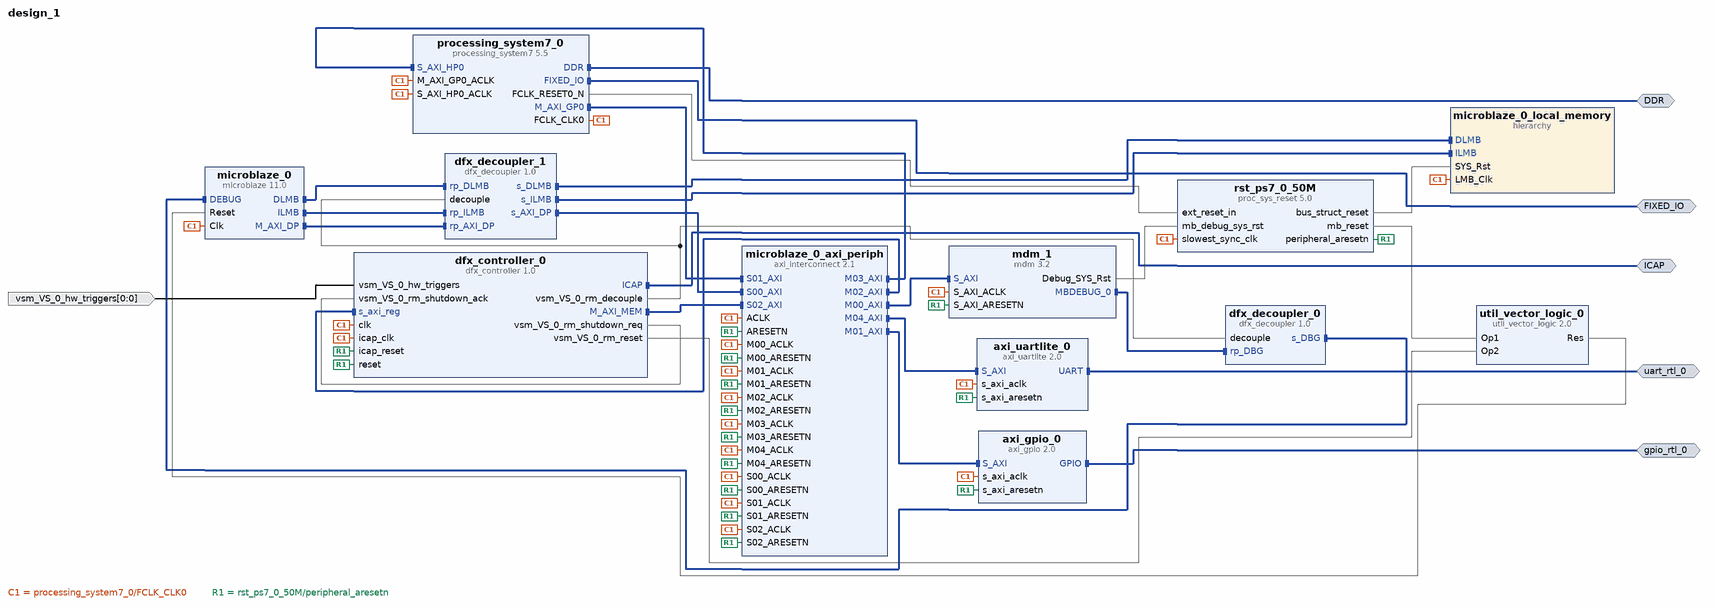
[diagram p0: block diagram of the top level]
# Vivado block design design_1, xc7z020clg400-1, Vivado 2021.1
create_bd_design design_1

create_bd_intf_port -mode Master -vlnv xilinx.com:display_processing_system7:fixedio_rtl:1.0 FIXED_IO
create_bd_intf_port -mode Master -vlnv xilinx.com:interface:gpio_rtl:1.0 gpio_rtl_0
create_bd_intf_port -mode Master -vlnv xilinx.com:interface:icap_rtl:1.0 ICAP
create_bd_intf_port -mode Master -vlnv xilinx.com:interface:ddrx_rtl:1.0 DDR
create_bd_intf_port -mode Master -vlnv xilinx.com:interface:uart_rtl:1.0 uart_rtl_0
create_bd_port -dir I -from 0 -to 0 vsm_VS_0_hw_triggers

create_bd_cell -type hier microblaze_0_local_memory
create_bd_cell -type ip -vlnv xilinx.com:ip:axi_interconnect:2.1 microblaze_0_axi_periph
set_property -dict {CONFIG.NUM_MI 5 CONFIG.NUM_SI 3} [get_bd_cells microblaze_0_axi_periph]
create_bd_cell -type ip -vlnv xilinx.com:ip:mdm:3.2 mdm_1
set_property -dict {CONFIG.C_ADDR_SIZE 32 CONFIG.C_M_AXI_ADDR_WIDTH 32 CONFIG.C_USE_UART 1} [get_bd_cells mdm_1]
create_bd_cell -type ip -vlnv xilinx.com:ip:proc_sys_reset:5.0 rst_ps7_0_50M
create_bd_cell -type ip -vlnv xilinx.com:ip:microblaze:11.0 microblaze_0
set_property -dict {CONFIG.C_D_AXI 1} [get_bd_cells microblaze_0]
create_bd_cell -type ip -vlnv xilinx.com:ip:axi_gpio:2.0 axi_gpio_0
set_property -dict {CONFIG.C_ALL_OUTPUTS 1 CONFIG.C_GPIO_WIDTH 1} [get_bd_cells axi_gpio_0]
create_bd_cell -type ip -vlnv xilinx.com:ip:dfx_controller:1.0 dfx_controller_0
set_property -dict [list \
  CONFIG.ALL_PARAMS {HAS_AXI_LITE_IF 1 RESET_ACTIVE_LEVEL 0 CP_FIFO_DEPTH 32 CP_FIFO_TYPE lutram CDC_STAGES 6 VS {VS_0 {ID 0 NAME VS_0 RM {UBLAZE {ID 0 NAME UBLAZE BS {0 {ID 0 ADDR 268435456 SIZE 389928 CLEAR 0}} RESET_REQUIRED high}} POR_RM UBLAZE HAS_POR_RM 1 NUM_HW_TRIGGERS 1}} CP_FAMILY 7series DIRTY 0} \
  CONFIG.GUI_BS_ADDRESS_0 0x10000000 \
  CONFIG.GUI_BS_SIZE_0 389928 \
  CONFIG.GUI_RM_NEW_NAME UBLAZE \
  CONFIG.GUI_RM_RESET_REQUIRED high \
  CONFIG.GUI_VS_HAS_POR_RM true \
  CONFIG.GUI_VS_NUM_HW_TRIGGERS 1 \
] [get_bd_cells dfx_controller_0]
create_bd_cell -type ip -vlnv xilinx.com:ip:util_vector_logic:2.0 util_vector_logic_0
set_property -dict {CONFIG.C_OPERATION or CONFIG.C_SIZE 1} [get_bd_cells util_vector_logic_0]
create_bd_cell -type ip -vlnv xilinx.com:ip:dfx_decoupler:1.0 dfx_decoupler_0
set_property -dict [list \
  CONFIG.ALL_PARAMS {INTF {DBG {ID 0 VLNV xilinx.com:interface:mbdebug_rtl:3.0 SIGNALS {CLK {PRESENT 1 WIDTH 1} TDI {PRESENT 1 WIDTH 1} TDO {PRESENT 1 WIDTH 1} REG_EN {PRESENT 1 WIDTH 8} SHIFT {PRESENT 1 WIDTH 1} CAPTURE {PRESENT 1 WIDTH 1} UPDATE {PRESENT 1 WIDTH 1} RST {PRESENT 1 WIDTH 1} TRIG_IN {PRESENT 1 WIDTH 1} TRIG_ACK_IN {PRESENT 1 WIDTH 1} TRIG_OUT {PRESENT 1 WIDTH 1} TRIG_ACK_OUT {PRESENT 1 WIDTH 1} TRCLK {PRESENT 1 WIDTH 1} TRDATA {PRESENT 1 WIDTH 1} TRREADY {PRESENT 1 WIDTH 1} TRVALID {PRESENT 1 WIDTH 1} AWADDR {PRESENT 1 WIDTH 1} AWVALID {PRESENT 1 WIDTH 1} AWREADY {PRESENT 1 WIDTH 1} WDATA {PRESENT 1 WIDTH 1} WVALID {PRESENT 1 WIDTH 1} WREADY {PRESENT 1 WIDTH 1} BRESP {PRESENT 1 WIDTH 1} BVALID {PRESENT 1 WIDTH 1} BREADY {PRESENT 1 WIDTH 1} ARADDR {PRESENT 1 WIDTH 1} ARVALID {PRESENT 1 WIDTH 1} ARREADY {PRESENT 1 WIDTH 1} RDATA {PRESENT 1 WIDTH 1} RRESP {PRESENT 1 WIDTH 1} RVALID {PRESENT 1 WIDTH 1} RREADY {PRESENT 1 WIDTH 1} DISABLE {PRESENT 1 WIDTH 1}}}} HAS_SIGNAL_STATUS 0 IPI_PROP_COUNT 0} \
  CONFIG.GUI_HAS_SIGNAL_STATUS false \
  CONFIG.GUI_INTERFACE_NAME DBG \
  CONFIG.GUI_SELECT_INTERFACE 0 \
  CONFIG.GUI_SELECT_VLNV xilinx.com:interface:mbdebug_rtl:3.0 \
  CONFIG.GUI_SIGNAL_DECOUPLED_0 true \
  CONFIG.GUI_SIGNAL_DECOUPLED_1 true \
  CONFIG.GUI_SIGNAL_DECOUPLED_2 true \
  CONFIG.GUI_SIGNAL_DECOUPLED_3 true \
  CONFIG.GUI_SIGNAL_DECOUPLED_4 true \
  CONFIG.GUI_SIGNAL_DECOUPLED_5 true \
  CONFIG.GUI_SIGNAL_DECOUPLED_6 true \
  CONFIG.GUI_SIGNAL_DECOUPLED_7 true \
  CONFIG.GUI_SIGNAL_DECOUPLED_8 true \
  CONFIG.GUI_SIGNAL_DECOUPLED_9 true \
  CONFIG.GUI_SIGNAL_SELECT_0 CLK \
  CONFIG.GUI_SIGNAL_SELECT_1 TDI \
  CONFIG.GUI_SIGNAL_SELECT_2 TDO \
  CONFIG.GUI_SIGNAL_SELECT_3 REG_EN \
  CONFIG.GUI_SIGNAL_SELECT_4 SHIFT \
  CONFIG.GUI_SIGNAL_SELECT_5 CAPTURE \
  CONFIG.GUI_SIGNAL_SELECT_6 UPDATE \
  CONFIG.GUI_SIGNAL_SELECT_7 RST \
  CONFIG.GUI_SIGNAL_SELECT_8 TRIG_IN \
  CONFIG.GUI_SIGNAL_SELECT_9 TRIG_ACK_IN \
] [get_bd_cells dfx_decoupler_0]
create_bd_cell -type ip -vlnv xilinx.com:ip:dfx_decoupler:1.0 dfx_decoupler_1
set_property -dict [list \
  CONFIG.ALL_PARAMS {HAS_SIGNAL_STATUS 0 INTF {DLMB {ID 0 VLNV xilinx.com:interface:lmb_rtl:1.0 SIGNALS {RST {PRESENT 1 WIDTH 1} ABUS {PRESENT 1 WIDTH 32} READSTROBE {PRESENT 1 WIDTH 1} WRITESTROBE {PRESENT 1 WIDTH 1} ADDRSTROBE {PRESENT 1 WIDTH 1} ADDRTAG {PRESENT 1 WIDTH 1} WRITEDBUS {PRESENT 1 WIDTH 32} BE {PRESENT 1 WIDTH 4} READY {PRESENT 1 WIDTH 1} WAIT {PRESENT 1 WIDTH 1} CE {PRESENT 1 WIDTH 1} UE {PRESENT 1 WIDTH 1} READDBUS {PRESENT 1 WIDTH 32}}} ILMB {ID 1 VLNV xilinx.com:interface:lmb_rtl:1.0 SIGNALS {RST {PRESENT 0 WIDTH 1 MANAGEMENT manual} ABUS {PRESENT 1 WIDTH 32} READSTROBE {PRESENT 1 WIDTH 1} WRITESTROBE {PRESENT 0 DIRECTION in WIDTH 1 MANAGEMENT manual} ADDRSTROBE {PRESENT 1 WIDTH 1} ADDRTAG {PRESENT 0 DIRECTION in WIDTH 1 MANAGEMENT manual} WRITEDBUS {PRESENT 0 DIRECTION in WIDTH 1 MANAGEMENT manual} BE {PRESENT 0 DIRECTION in WIDTH 1 MANAGEMENT manual} READY {PRESENT 1 WIDTH 1} WAIT {PRESENT 1 WIDTH 1} CE {PRESENT 1 WIDTH 1} UE {PRESENT 1 WIDTH 1} READDBUS {PRESENT 1 WIDTH 32}}} AXI_DP {ID 2 VLNV xilinx.com:interface:aximm_rtl:1.0 SIGNALS {ARVALID {PRESENT 1 WIDTH 1} ARREADY {PRESENT 1 WIDTH 1} AWVALID {PRESENT 1 WIDTH 1} AWREADY {PRESENT 1 WIDTH 1} BVALID {PRESENT 1 WIDTH 1} BREADY {PRESENT 1 WIDTH 1} RVALID {PRESENT 1 WIDTH 1} RREADY {PRESENT 1 WIDTH 1} WVALID {PRESENT 1 WIDTH 1} WREADY {PRESENT 1 WIDTH 1} AWID {PRESENT 0 WIDTH 0} AWADDR {PRESENT 1 WIDTH 32} AWLEN {PRESENT 0 WIDTH 8} AWSIZE {PRESENT 0 WIDTH 3} AWBURST {PRESENT 0 WIDTH 2} AWLOCK {PRESENT 0 WIDTH 1} AWCACHE {PRESENT 0 WIDTH 4} AWPROT {PRESENT 1 WIDTH 3} AWREGION {PRESENT 1 WIDTH 4} AWQOS {PRESENT 1 WIDTH 4} AWUSER {PRESENT 0 WIDTH 0} WID {PRESENT 0 WIDTH 0} WDATA {PRESENT 1 WIDTH 32} WSTRB {PRESENT 1 WIDTH 4} WLAST {PRESENT 0 WIDTH 1} WUSER {PRESENT 0 WIDTH 0} BID {PRESENT 0 WIDTH 0} BRESP {PRESENT 1 WIDTH 2} BUSER {PRESENT 0 WIDTH 0} ARID {PRESENT 0 WIDTH 0} ARADDR {PRESENT 1 WIDTH 32} ARLEN {PRESENT 0 WIDTH 8} ARSIZE {PRESENT 0 WIDTH 3} ARBURST {PRESENT 0 WIDTH 2} ARLOCK {PRESENT 0 WIDTH 1} ARCACHE {PRESENT 0 WIDTH 4} ARPROT {PRESENT 1 WIDTH 3} ARREGION {PRESENT 1 WIDTH 4} ARQOS {PRESENT 1 WIDTH 4} ARUSER {PRESENT 0 WIDTH 0} RID {PRESENT 0 WIDTH 0} RDATA {PRESENT 1 WIDTH 32} RRESP {PRESENT 1 WIDTH 2} RLAST {PRESENT 0 WIDTH 1} RUSER {PRESENT 0 WIDTH 0}} PROTOCOL axi4lite}} IPI_PROP_COUNT 304} \
  CONFIG.GUI_HAS_SIGNAL_STATUS 0 \
  CONFIG.GUI_INTERFACE_NAME DLMB \
  CONFIG.GUI_SELECT_INTERFACE 0 \
  CONFIG.GUI_SELECT_VLNV xilinx.com:interface:lmb_rtl:1.0 \
  CONFIG.GUI_SIGNAL_DECOUPLED_0 true \
  CONFIG.GUI_SIGNAL_DECOUPLED_1 true \
  CONFIG.GUI_SIGNAL_DECOUPLED_2 true \
  CONFIG.GUI_SIGNAL_DECOUPLED_3 true \
  CONFIG.GUI_SIGNAL_DECOUPLED_4 true \
  CONFIG.GUI_SIGNAL_DECOUPLED_5 true \
  CONFIG.GUI_SIGNAL_DECOUPLED_6 true \
  CONFIG.GUI_SIGNAL_DECOUPLED_7 true \
  CONFIG.GUI_SIGNAL_DECOUPLED_8 true \
  CONFIG.GUI_SIGNAL_DECOUPLED_9 true \
  CONFIG.GUI_SIGNAL_DIRECTION_3 s \
  CONFIG.GUI_SIGNAL_DIRECTION_5 s \
  CONFIG.GUI_SIGNAL_DIRECTION_6 s \
  CONFIG.GUI_SIGNAL_DIRECTION_7 s \
  CONFIG.GUI_SIGNAL_MANAGEMENT_0 auto \
  CONFIG.GUI_SIGNAL_MANAGEMENT_3 auto \
  CONFIG.GUI_SIGNAL_MANAGEMENT_5 auto \
  CONFIG.GUI_SIGNAL_MANAGEMENT_6 auto \
  CONFIG.GUI_SIGNAL_MANAGEMENT_7 auto \
  CONFIG.GUI_SIGNAL_SELECT_0 RST \
  CONFIG.GUI_SIGNAL_SELECT_1 ABUS \
  CONFIG.GUI_SIGNAL_SELECT_2 READSTROBE \
  CONFIG.GUI_SIGNAL_SELECT_3 WRITESTROBE \
  CONFIG.GUI_SIGNAL_SELECT_4 ADDRSTROBE \
  CONFIG.GUI_SIGNAL_SELECT_5 ADDRTAG \
  CONFIG.GUI_SIGNAL_SELECT_6 WRITEDBUS \
  CONFIG.GUI_SIGNAL_SELECT_7 BE \
  CONFIG.GUI_SIGNAL_SELECT_8 READY \
  CONFIG.GUI_SIGNAL_SELECT_9 WAIT \
] [get_bd_cells dfx_decoupler_1]
create_bd_cell -type ip -vlnv xilinx.com:ip:processing_system7:5.5 processing_system7_0
set_property -dict [list \
  CONFIG.PCW_CRYSTAL_PERIPHERAL_FREQMHZ 50 \
  CONFIG.PCW_UIPARAM_DDR_BUS_WIDTH {16 Bit} \
  CONFIG.PCW_UIPARAM_DDR_FREQ_MHZ 525 \
  CONFIG.PCW_UIPARAM_DDR_PARTNO {MT41J256M16 RE-125} \
  CONFIG.PCW_USE_S_AXI_HP0 1 \
] [get_bd_cells processing_system7_0]
# 50 more settings of processing_system7_0 are not shown: defaults, MIO pin electricals, DDR timing, and values the tool derives
create_bd_cell -type ip -vlnv xilinx.com:ip:axi_uartlite:2.0 axi_uartlite_0

# ---- hierarchy /microblaze_0_local_memory ----
current_bd_instance /microblaze_0_local_memory
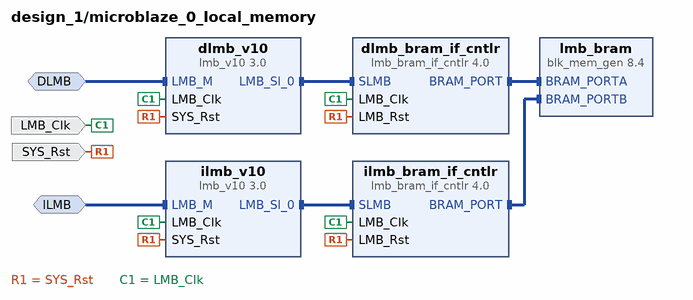
[diagram p1: block diagram inside /microblaze_0_local_memory]
create_bd_intf_pin -mode MirroredMaster -vlnv xilinx.com:interface:lmb_rtl:1.0 DLMB
create_bd_intf_pin -mode MirroredMaster -vlnv xilinx.com:interface:lmb_rtl:1.0 ILMB
create_bd_pin -dir I -type clk LMB_Clk
create_bd_pin -dir I -type rst SYS_Rst

create_bd_cell -type ip -vlnv xilinx.com:ip:lmb_v10:3.0 dlmb_v10
create_bd_cell -type ip -vlnv xilinx.com:ip:lmb_v10:3.0 ilmb_v10
create_bd_cell -type ip -vlnv xilinx.com:ip:lmb_bram_if_cntlr:4.0 dlmb_bram_if_cntlr
set_property -dict {CONFIG.C_ECC 0} [get_bd_cells dlmb_bram_if_cntlr]
create_bd_cell -type ip -vlnv xilinx.com:ip:lmb_bram_if_cntlr:4.0 ilmb_bram_if_cntlr
set_property -dict {CONFIG.C_ECC 0} [get_bd_cells ilmb_bram_if_cntlr]
create_bd_cell -type ip -vlnv xilinx.com:ip:blk_mem_gen:8.4 lmb_bram
set_property -dict {CONFIG.Memory_Type True_Dual_Port_RAM CONFIG.use_bram_block BRAM_Controller} [get_bd_cells lmb_bram]

# ---- connections ----

current_bd_instance /microblaze_0_local_memory
connect_bd_intf_net -intf_net microblaze_0_dlmb [get_bd_intf_pins DLMB] [get_bd_intf_pins dlmb_v10/LMB_M]
connect_bd_intf_net -intf_net microblaze_0_dlmb_bus [get_bd_intf_pins dlmb_v10/LMB_Sl_0] [get_bd_intf_pins dlmb_bram_if_cntlr/SLMB]
connect_bd_intf_net -intf_net microblaze_0_dlmb_cntlr [get_bd_intf_pins dlmb_bram_if_cntlr/BRAM_PORT] [get_bd_intf_pins lmb_bram/BRAM_PORTA]
connect_bd_intf_net -intf_net microblaze_0_ilmb [get_bd_intf_pins ILMB] [get_bd_intf_pins ilmb_v10/LMB_M]
connect_bd_intf_net -intf_net microblaze_0_ilmb_bus [get_bd_intf_pins ilmb_v10/LMB_Sl_0] [get_bd_intf_pins ilmb_bram_if_cntlr/SLMB]
connect_bd_intf_net -intf_net microblaze_0_ilmb_cntlr [get_bd_intf_pins ilmb_bram_if_cntlr/BRAM_PORT] [get_bd_intf_pins lmb_bram/BRAM_PORTB]
connect_bd_net [get_bd_pins SYS_Rst] \
  [get_bd_pins dlmb_v10/SYS_Rst] [get_bd_pins dlmb_bram_if_cntlr/LMB_Rst] [get_bd_pins ilmb_v10/SYS_Rst] \
  [get_bd_pins ilmb_bram_if_cntlr/LMB_Rst]
connect_bd_net -net microblaze_0_Clk [get_bd_pins LMB_Clk] \
  [get_bd_pins dlmb_v10/LMB_Clk] [get_bd_pins dlmb_bram_if_cntlr/LMB_Clk] [get_bd_pins ilmb_v10/LMB_Clk] \
  [get_bd_pins ilmb_bram_if_cntlr/LMB_Clk]
set_property HDL_ATTRIBUTE.BMM_INFO_ADDRESS_SPACE {byte  0x00000000 32 > design_1 microblaze_0_local_memory/lmb_bram} [get_bd_cells dlmb_bram_if_cntlr]
set_property HDL_ATTRIBUTE.KEEP_HIERARCHY yes [get_bd_cells dlmb_bram_if_cntlr]

current_bd_instance /
connect_bd_intf_net [get_bd_intf_pins microblaze_0_axi_periph/S01_AXI] [get_bd_intf_pins processing_system7_0/M_AXI_GP0]
connect_bd_intf_net [get_bd_intf_ports gpio_rtl_0] [get_bd_intf_pins axi_gpio_0/GPIO]
connect_bd_intf_net [get_bd_intf_ports uart_rtl_0] [get_bd_intf_pins axi_uartlite_0/UART]
connect_bd_intf_net [get_bd_intf_ports ICAP] [get_bd_intf_pins dfx_controller_0/ICAP]
connect_bd_intf_net [get_bd_intf_pins dfx_controller_0/M_AXI_MEM] [get_bd_intf_pins microblaze_0_axi_periph/S02_AXI]
connect_bd_intf_net [get_bd_intf_pins dfx_decoupler_0/s_DBG] [get_bd_intf_pins microblaze_0/DEBUG]
connect_bd_intf_net [get_bd_intf_pins dfx_decoupler_1/s_AXI_DP] [get_bd_intf_pins microblaze_0_axi_periph/S00_AXI]
connect_bd_intf_net [get_bd_intf_pins dfx_decoupler_1/s_DLMB] [get_bd_intf_pins microblaze_0_local_memory/DLMB]
connect_bd_intf_net [get_bd_intf_pins dfx_decoupler_1/s_ILMB] [get_bd_intf_pins microblaze_0_local_memory/ILMB]
connect_bd_intf_net [get_bd_intf_pins mdm_1/MBDEBUG_0] [get_bd_intf_pins dfx_decoupler_0/rp_DBG]
connect_bd_intf_net [get_bd_intf_pins microblaze_0/DLMB] [get_bd_intf_pins dfx_decoupler_1/rp_DLMB]
connect_bd_intf_net [get_bd_intf_pins microblaze_0/ILMB] [get_bd_intf_pins dfx_decoupler_1/rp_ILMB]
connect_bd_intf_net [get_bd_intf_pins microblaze_0/M_AXI_DP] [get_bd_intf_pins dfx_decoupler_1/rp_AXI_DP]
connect_bd_intf_net [get_bd_intf_pins microblaze_0_axi_periph/M01_AXI] [get_bd_intf_pins axi_gpio_0/S_AXI]
connect_bd_intf_net [get_bd_intf_pins dfx_controller_0/s_axi_reg] [get_bd_intf_pins microblaze_0_axi_periph/M02_AXI]
connect_bd_intf_net [get_bd_intf_pins processing_system7_0/S_AXI_HP0] [get_bd_intf_pins microblaze_0_axi_periph/M03_AXI]
connect_bd_intf_net [get_bd_intf_pins axi_uartlite_0/S_AXI] [get_bd_intf_pins microblaze_0_axi_periph/M04_AXI]
connect_bd_intf_net -intf_net microblaze_0_mdm_axi [get_bd_intf_pins microblaze_0_axi_periph/M00_AXI] [get_bd_intf_pins mdm_1/S_AXI]
connect_bd_intf_net [get_bd_intf_ports DDR] [get_bd_intf_pins processing_system7_0/DDR]
connect_bd_intf_net [get_bd_intf_ports FIXED_IO] [get_bd_intf_pins processing_system7_0/FIXED_IO]
connect_bd_net [get_bd_pins dfx_controller_0/vsm_VS_0_rm_decouple] [get_bd_pins dfx_decoupler_1/decouple] [get_bd_pins dfx_decoupler_0/decouple]
connect_bd_net [get_bd_pins dfx_controller_0/vsm_VS_0_rm_reset] [get_bd_pins util_vector_logic_0/Op2]
connect_bd_net [get_bd_pins dfx_controller_0/vsm_VS_0_rm_shutdown_req] [get_bd_pins dfx_controller_0/vsm_VS_0_rm_shutdown_ack]
connect_bd_net [get_bd_pins mdm_1/Debug_SYS_Rst] [get_bd_pins rst_ps7_0_50M/mb_debug_sys_rst]
connect_bd_net -net microblaze_0_Clk [get_bd_pins processing_system7_0/FCLK_CLK0] \
  [get_bd_pins microblaze_0_axi_periph/ACLK] [get_bd_pins microblaze_0_axi_periph/S00_ACLK] \
  [get_bd_pins microblaze_0_axi_periph/M00_ACLK] [get_bd_pins microblaze_0_local_memory/LMB_Clk] \
  [get_bd_pins mdm_1/S_AXI_ACLK] [get_bd_pins rst_ps7_0_50M/slowest_sync_clk] [get_bd_pins microblaze_0_axi_periph/S01_ACLK] \
  [get_bd_pins microblaze_0/Clk] [get_bd_pins axi_gpio_0/s_axi_aclk] [get_bd_pins microblaze_0_axi_periph/M01_ACLK] \
  [get_bd_pins dfx_controller_0/clk] [get_bd_pins dfx_controller_0/icap_clk] [get_bd_pins microblaze_0_axi_periph/M02_ACLK] \
  [get_bd_pins microblaze_0_axi_periph/S02_ACLK] [get_bd_pins processing_system7_0/M_AXI_GP0_ACLK] \
  [get_bd_pins microblaze_0_axi_periph/M03_ACLK] [get_bd_pins processing_system7_0/S_AXI_HP0_ACLK] \
  [get_bd_pins axi_uartlite_0/s_axi_aclk] [get_bd_pins microblaze_0_axi_periph/M04_ACLK]
connect_bd_net [get_bd_pins processing_system7_0/FCLK_RESET0_N] [get_bd_pins rst_ps7_0_50M/ext_reset_in]
connect_bd_net [get_bd_pins rst_ps7_0_50M/bus_struct_reset] [get_bd_pins microblaze_0_local_memory/SYS_Rst]
connect_bd_net [get_bd_pins rst_ps7_0_50M/mb_reset] [get_bd_pins util_vector_logic_0/Op1]
connect_bd_net [get_bd_pins rst_ps7_0_50M/peripheral_aresetn] \
  [get_bd_pins microblaze_0_axi_periph/ARESETN] [get_bd_pins microblaze_0_axi_periph/S00_ARESETN] \
  [get_bd_pins microblaze_0_axi_periph/M00_ARESETN] [get_bd_pins mdm_1/S_AXI_ARESETN] \
  [get_bd_pins microblaze_0_axi_periph/S01_ARESETN] [get_bd_pins axi_gpio_0/s_axi_aresetn] \
  [get_bd_pins microblaze_0_axi_periph/M01_ARESETN] [get_bd_pins dfx_controller_0/reset] \
  [get_bd_pins dfx_controller_0/icap_reset] [get_bd_pins microblaze_0_axi_periph/M02_ARESETN] \
  [get_bd_pins microblaze_0_axi_periph/S02_ARESETN] [get_bd_pins microblaze_0_axi_periph/M03_ARESETN] \
  [get_bd_pins axi_uartlite_0/s_axi_aresetn] [get_bd_pins microblaze_0_axi_periph/M04_ARESETN]
connect_bd_net [get_bd_pins util_vector_logic_0/Res] [get_bd_pins microblaze_0/Reset]
connect_bd_net [get_bd_ports vsm_VS_0_hw_triggers] [get_bd_pins dfx_controller_0/vsm_VS_0_hw_triggers]
set_property HDL_ATTRIBUTE.BMM_INFO_PROCESSOR {microblaze-le > design_1 microblaze_0_local_memory/dlmb_bram_if_cntlr} [get_bd_cells microblaze_0]
set_property HDL_ATTRIBUTE.KEEP_HIERARCHY yes [get_bd_cells microblaze_0]

# ---- address map ----
assign_bd_address -offset 0x10000000 -range 256M -target_address_space [get_bd_addr_spaces dfx_controller_0/Data] [get_bd_addr_segs processing_system7_0/S_AXI_HP0/HP0_DDR_LOWOCM]
assign_bd_address -offset 0x40600000 -range 64K -target_address_space [get_bd_addr_spaces dfx_controller_0/Data] [get_bd_addr_segs axi_uartlite_0/S_AXI/Reg]
assign_bd_address -offset 0x41200000 -range 64K -target_address_space [get_bd_addr_spaces dfx_controller_0/Data] [get_bd_addr_segs axi_gpio_0/S_AXI/Reg]
assign_bd_address -offset 0x41400000 -range 4K -target_address_space [get_bd_addr_spaces dfx_controller_0/Data] [get_bd_addr_segs mdm_1/S_AXI/Reg]
assign_bd_address -offset 0x44A00000 -range 64K -target_address_space [get_bd_addr_spaces dfx_controller_0/Data] [get_bd_addr_segs dfx_controller_0/s_axi_reg/Reg]
assign_bd_address -offset 0x00000000 -range 8K -target_address_space [get_bd_addr_spaces microblaze_0/Data] [get_bd_addr_segs microblaze_0_local_memory/dlmb_bram_if_cntlr/SLMB/Mem]
assign_bd_address -offset 0x10000000 -range 256M -target_address_space [get_bd_addr_spaces microblaze_0/Data] [get_bd_addr_segs processing_system7_0/S_AXI_HP0/HP0_DDR_LOWOCM]
assign_bd_address -offset 0x40600000 -range 64K -target_address_space [get_bd_addr_spaces microblaze_0/Data] [get_bd_addr_segs axi_uartlite_0/S_AXI/Reg]
assign_bd_address -offset 0x41200000 -range 64K -target_address_space [get_bd_addr_spaces microblaze_0/Data] [get_bd_addr_segs axi_gpio_0/S_AXI/Reg]
assign_bd_address -offset 0x41400000 -range 4K -target_address_space [get_bd_addr_spaces microblaze_0/Data] [get_bd_addr_segs mdm_1/S_AXI/Reg]
assign_bd_address -offset 0x44A00000 -range 64K -target_address_space [get_bd_addr_spaces microblaze_0/Data] [get_bd_addr_segs dfx_controller_0/s_axi_reg/Reg]
assign_bd_address -offset 0x00000000 -range 8K -target_address_space [get_bd_addr_spaces microblaze_0/Instruction] [get_bd_addr_segs microblaze_0_local_memory/ilmb_bram_if_cntlr/SLMB/Mem]
assign_bd_address -offset 0x40600000 -range 64K -target_address_space [get_bd_addr_spaces processing_system7_0/Data] [get_bd_addr_segs axi_uartlite_0/S_AXI/Reg]
assign_bd_address -offset 0x41200000 -range 64K -target_address_space [get_bd_addr_spaces processing_system7_0/Data] [get_bd_addr_segs axi_gpio_0/S_AXI/Reg]
assign_bd_address -offset 0x41400000 -range 4K -target_address_space [get_bd_addr_spaces processing_system7_0/Data] [get_bd_addr_segs mdm_1/S_AXI/Reg]
assign_bd_address -offset 0x44A00000 -range 64K -target_address_space [get_bd_addr_spaces processing_system7_0/Data] [get_bd_addr_segs dfx_controller_0/s_axi_reg/Reg]
exclude_bd_addr_seg -offset 0x00000000 -range 1 -target_address_space [get_bd_addr_spaces processing_system7_0/Data] [get_bd_addr_segs processing_system7_0/S_AXI_HP0/HP0_DDR_LOWOCM]

validate_bd_design
save_bd_design
